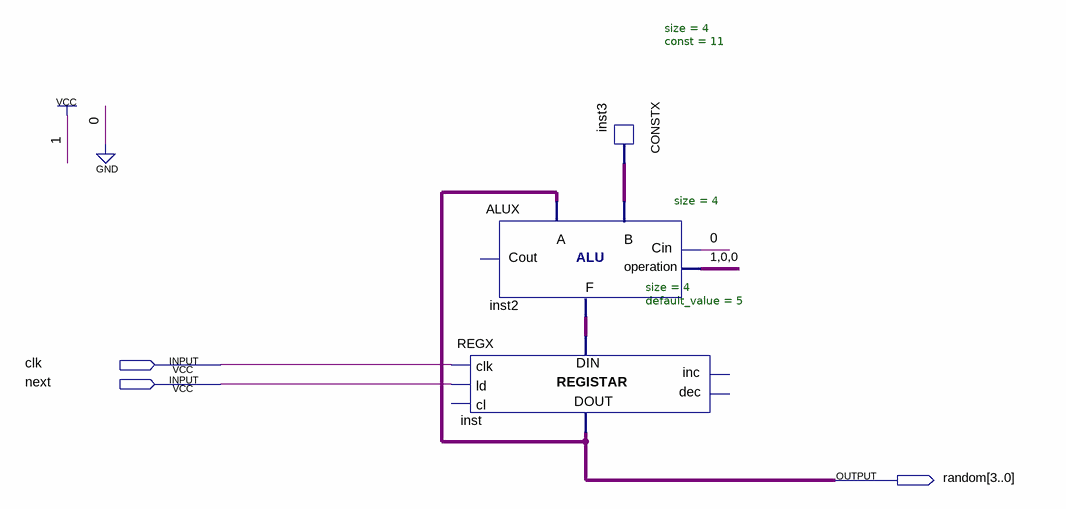
[diagram p0: schematic sheet]
// Quartus schematic rand.bdf as structural Verilog: 3 symbols, 3 pins
module \rand  (
  input  clk,
  input  next,
  output [3:0] random
);

  wire [3:0] inst2_f, inst3_data;

  ALUX #(.size(4)) inst2 (.Cin(1'b0), .B(inst3_data), .A(random), .op(3'b100), .F(inst2_f));  // open: Cout
  REGX #(.size(4), .default_value(5)) inst (
    .clk(clk), .ld(next), .data_in(inst2_f), .data_out(random));  // open: cl, inc, dec
  CONSTX #(.size(4), .\const (11)) inst3 (.data(inst3_data));
endmodule
